# Altium schematic sheet Power Switch.SchDoc
size A3; SheetNumber: 3; SheetTotal: 5
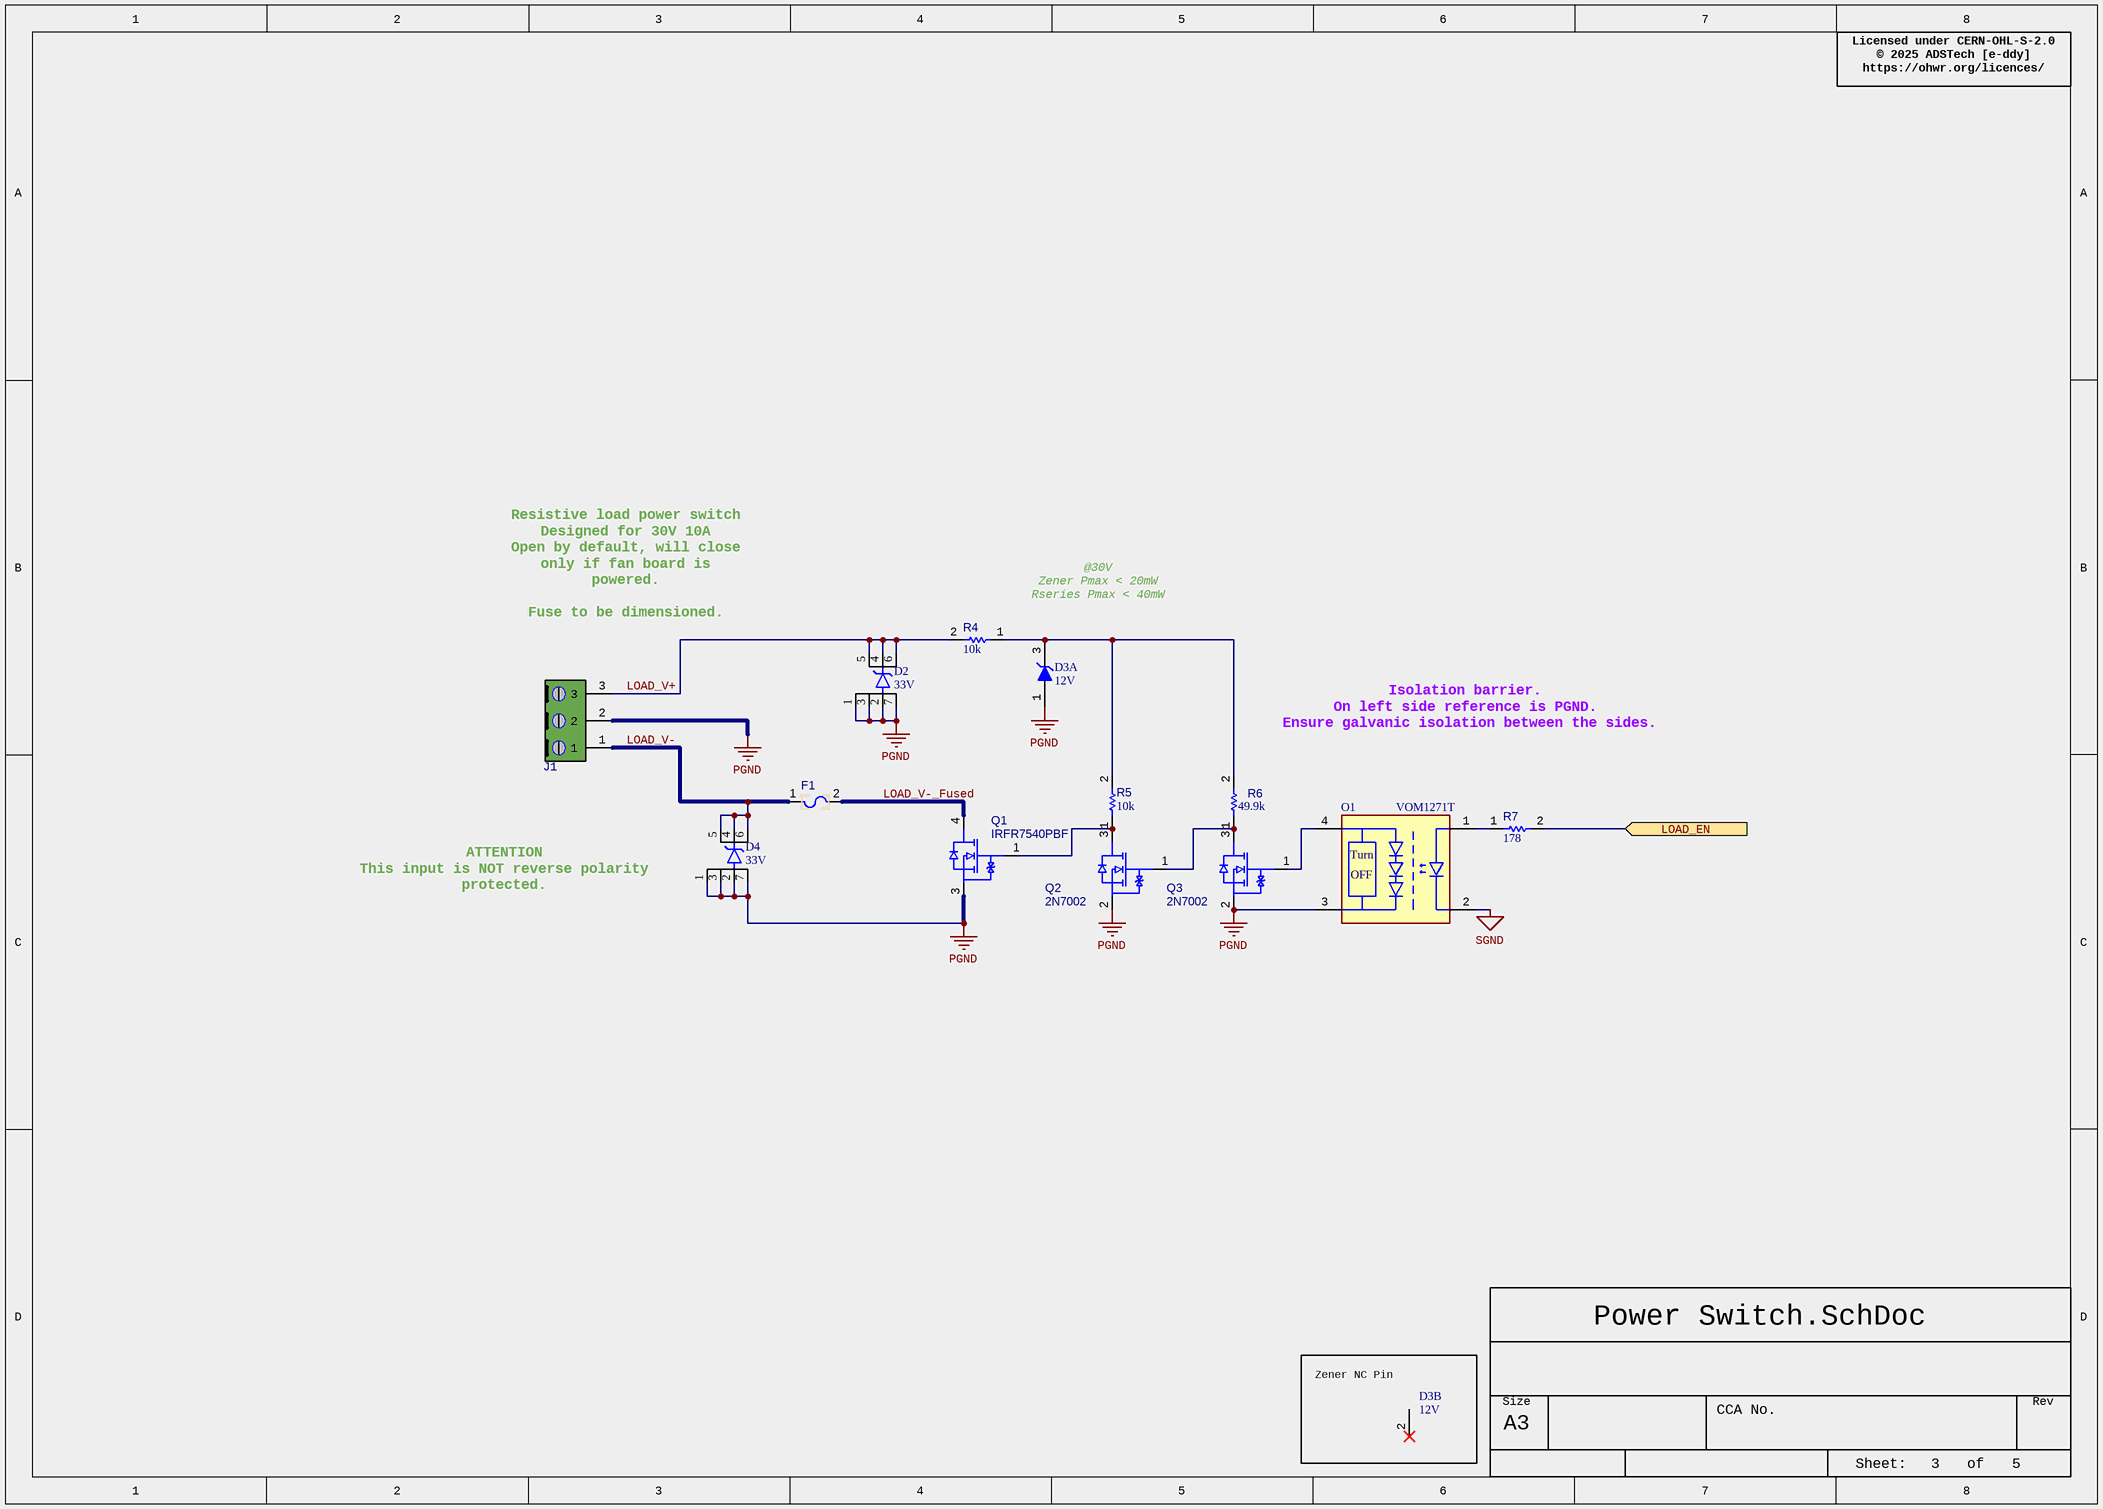
[diagram p0: Power Switch.SchDoc]

## Parts
D2  33V  [FP-DRV0006A-MFG]
D3  Reference Voltage-Nom: 12V  [FP-SOT23-MFG]  (hidden comment: D-ZEN-12V-BZX84C12-7-F)  (parts A,B of 2)
D4  33V  [FP-DRV0006A-MFG]
F1  FUSE-HOLDER-Nanofuse  [FP-0155-MFG]  (value not drawn)
J1  CON-TERM-3-5.08-30/12AWG  [TBJ05-03-1-G-G-Footprint-1]  (value not drawn)
O1  VOM1271T  [IC-Optocoupler-VOM1271T-Footprint-1]
Q1  IRFR7540PBF  [FP-PG-TO252-3-MFG]
Q2  2N7002  [FP-SOT23-MFG]
Q3  2N7002  [FP-SOT23-MFG]
R4  value 10k  [RES-0603-IPC_B]  (hidden comment: R-0603-10000.0-1%-100ppm-0.1)
R5  value 10k  [RES-0603-IPC_B]  (hidden comment: R-0603-10000.0-1%-100ppm-0.1)
R6  value 49.9k  [RES-0603-IPC_B]  (hidden comment: R-0603-49900.0-1%-100ppm-0.1)
R7  value 178  [RES-0603-IPC_B]  (hidden comment: R-0603-178.0-1%-100ppm-0.1)

## Blocks framed on the sheet
Zener NC Pin: D3

## Ports
LOAD_EN (in, see Block diagram[3B], MCU[2C])

## Nets
PGND: D2.1(GND) D2.2(GND) D2.3(GND) D2.7(GND) D3.1(A) D4.1(GND) D4.2(GND) D4.3(GND) D4.7(GND) J1.2 O1.3(S) Q1.3(S) Q2.2(S) Q3.2(S)
SGND: O1.2(K)
LOAD_EN: R7.2 ; port LOAD_EN
LOAD_V+: D2.4(IN) D2.5(IN) D2.6(IN) J1.3 R4.2
LOAD_V-: D4.4(IN) D4.5(IN) D4.6(IN) F1.1 J1.1
LOAD_V-_Fused: F1.2 Q1.4(D)
NetD3_3: D3.3(C) R4.1 R5.2 R6.2
NetO1_1: O1.1(A) R7.1
NetO1_4: O1.4(D) Q3.1(G)
NetQ1_1: Q1.1(G) Q2.3(D) R5.1
NetQ2_1: Q2.1(G) Q3.3(D) R6.1

Not connected (* = marked no-connect by the designer): D3 2(NC)*

## Notes on the sheet
- Licensed under CERN-OHL-S-2.0
  © 2025 ADSTech [e-ddy]
  https://ohwr.org/licences/
- Resistive load power switch
  Designed for 30V 10A
  Open by default, will close only if fan board is powered.
  Fuse to be dimensioned.
- @30V
  Zener Pmax < 20mW
  Rseries Pmax < 40mW
- Isolation barrier.
  On left side reference is PGND.
  Ensure galvanic isolation between the sides.
- (near D4) ATTENTION
  This input is NOT reverse polarity protected.
- Size
- A3
- CCA No.
- Sheet:
- of
- Rev
- (in symbol CMP-00026-00001-1) Turn; OFF

## Library data of the parts
D2 D4 = CMP-004-00011-2: Trans Voltage Suppressor Diode, 33V V(RWM), Unidirectional, Silicon; Reach SVHC Compliant: Yes; Diode Type: TRANS VOLTAGE SUPPRESSOR; JESD-609 Code: e4; RoHS Compliant: Yes; Peak Reflow Temperature (Cel): 260°C; Terminal Finish: Nickel; Moisture Sensitivity Level: 2
D3 = CMP-004-00009-2: Zener Diode, 12V V(Z), 5.39%, 0.35W, Silicon, Unidirectional; Number of Elements: 1; Qualification Status: Not Qualified; Additional Feature: HIGH RELIABILITY; Package Body Material: Plastic; Max Power Dissipation: 350mW; Dynamic Impedance-Max: 25R; Test Current: 5mA; Time @ Peak Reflow Temperature-Max (s): 40s; Terminal Form: Gull Wing; Max Operating Temperature: 150°C; Diode Element Material: SILICON; RoHS Compliant: Yes; Min Operating Temperature: -65°C; JESD-30 Code: R-PDSO-G3; Package Shape: Rectangular; Reach SVHC Compliant: Yes; Moisture Sensitivity Level: 1; Surface Mount: Yes; Terminal Position: DUAL; Diode Type: ZENER; Technology: ZENER; JESD-609 Code: e3; Voltage Tol-Max: 5.39%; Polarity: Unidirectional; Package Style: SMALL OUTLINEMeter; Peak Reflow Temperature (Cel): 260°C; Pins: 3; Terminal Finish: Tin
F1 = CMP-005-00003-1: Fuses/Accessories
J1 = CMP-002-00037-2: Terminal Block, Wtb, 3POS, 30-12AWG;
O1 = CMP-00026-00001-1: Buffer/Inverter Based MOSFET Driver, 0.000007A, PDSO4; Channels: 1; Package Body Material: Plastic; High Side Driver: No; Interface IC Type: BUFFER OR INVERTER BASED MOSFET DRIVER; RoHS Compliant: Yes; Length: 4.57mm; Terminal Position: DUAL; Temperature Grade: INDUSTRIAL; Height - Seated (Max): 2.42mm; Max Operating Temperature: 100°C; Package Shape: Rectangular; Pins: 4; Terminal Pitch: 2.54mm; JESD-30 Code: R-PDSO-G4; Width: 4.42mm; Min Operating Temperature: -40°C; Surface Mount: Yes; Case/Package: SOP; Package Style: SMALL OUTLINEMeter; Terminal Form: Gull Wing
Q1 = CMP-013-00011-1: Power Field-Effect Transistor; Moisture Sensitivity Level: 1; RoHS Compliant: Yes; Reach SVHC Compliant: Yes
Q2 Q3 = CMP-013-00012-1: Small Signal Field-Effect Transistor, 0.115A I(D), 60V, 1-Element, N-Channel, Silicon, Metal-oxide Semiconductor FET; Feedback Cap-Max (Crss): 5pF; Drain-source On Resistance-Max: 13.5R; Time @ Peak Reflow Temperature-Max (s): 40s; Transistor Application: SWITCHING; Package Body Material: Plastic; Qualification Status: Not Qualified; Power Dissipation-Max (Abs): 300mW; Number of Elements: 1; Drain Current-Max (ID): 115mA; Operating Mode: ENHANCEMENT MODE; JESD-609 Code: e3; Polarity/Channel Type: N-CHANNEL; JESD-30 Code: R-PDSO-G3; Package Style: SMALL OUTLINEMeter; Pins: 3; FET Technology: METAL-OXIDE SEMICONDUCTOR; Max Operating Temperature: 150°C; Terminal Finish: Tin; Surface Mount: Yes; Peak Reflow Temperature (Cel): 260°C; DS Breakdown Voltage-Min: 60V; Transistor Element Material: SILICON; Reach SVHC Compliant: Yes; Package Shape: Rectangular; RoHS Compliant: Yes; Moisture Sensitivity Level: 1; Terminal Form: Gull Wing; Terminal Position: DUAL; Drain Current-Max (Abs) (ID): 115mA
R4 R5 = RES-0603-00288-2: 0603 10000.0 Ω 1% 100ppm 0.1W Resistor; MPN: CRCW060310K0FKED; TCR: 100; Power: 100mW; Package: 0603; Tolerance: 1%
R6 = RES-0603-00355-2: 0603 49900.0 Ω 1% 100ppm 0.1W Resistor; MPN: CRCW060349K9FKED; TCR: 100; Power: 100mW; Tolerance: 1%; Package: 0603
R7 = RES-0603-00120-2: 0603 178.0 Ω 1% 100ppm 0.1W Resistor; MPN: CRCW0603178RFKED; Power: 100mW; TCR: 100; Package: 0603; Tolerance: 1%